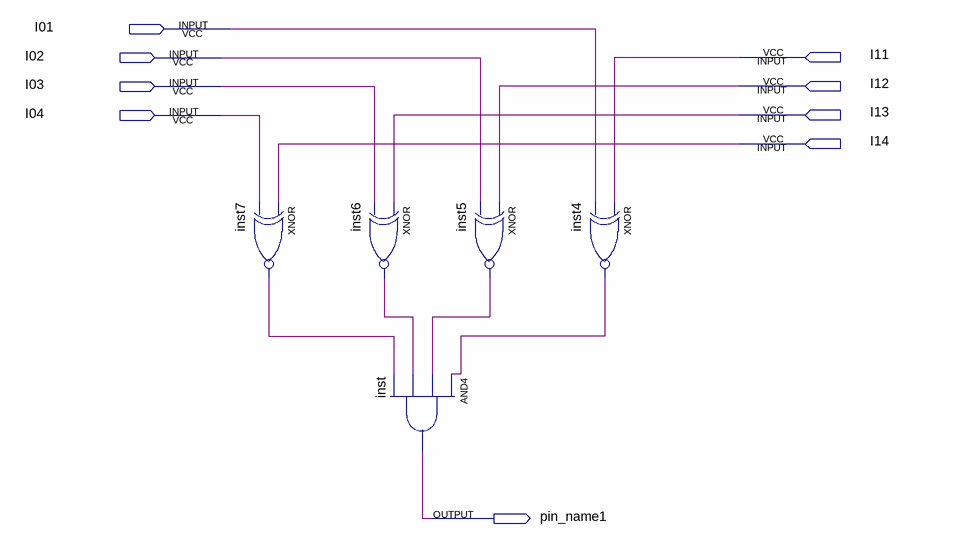
[diagram p0: schematic sheet]
// Quartus schematic EqCmpDemo.bdf as structural Verilog: 5 symbols, 9 pins
module EqCmpDemo (
  input  I01,
  input  I02,
  input  I11,
  input  I03,
  input  I12,
  input  I04,
  input  I13,
  input  I14,
  output pin_name1
);

  wire inst4_out, inst5_out, inst6_out, inst7_out;

  xnor inst7 (inst7_out, I14, I04);
  xnor inst6 (inst6_out, I13, I03);
  and inst (pin_name1, inst4_out, inst5_out, inst6_out, inst7_out);
  xnor inst5 (inst5_out, I12, I02);
  xnor inst4 (inst4_out, I11, I01);
endmodule
